# EAGLE design pcb_1love (EAGLE 9.6.1)
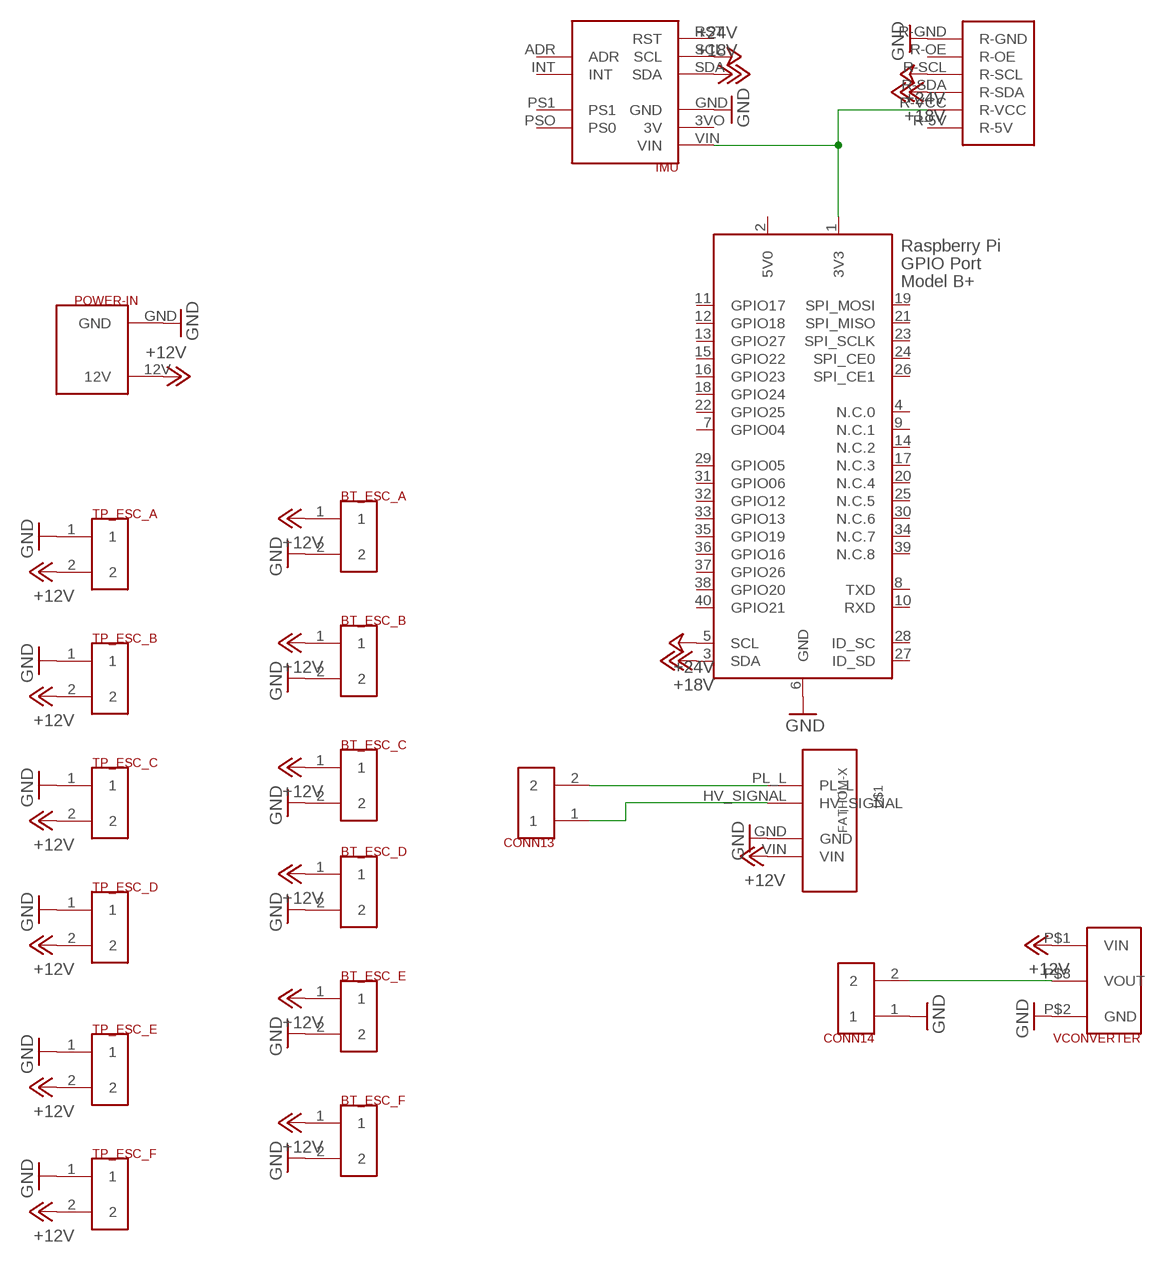
[diagram p0: schematic, sheet 1]

## Parts
BT_ESC_A  2CONTACT_ULTRAFIT_R/A  [2CONTAC_ULTRAFIT_R/A]
BT_ESC_B  2CONTACT_ULTRAFIT_R/A  [2CONTAC_ULTRAFIT_R/A]
BT_ESC_C  2CONTACT_ULTRAFIT_R/A  [2CONTAC_ULTRAFIT_R/A]
BT_ESC_D  2CONTACT_ULTRAFIT_R/A  [2CONTAC_ULTRAFIT_R/A]
BT_ESC_E  2CONTACT_ULTRAFIT_R/A  [2CONTAC_ULTRAFIT_R/A]
BT_ESC_F  2CONTACT_ULTRAFIT_R/A  [2CONTAC_ULTRAFIT_R/A]
CONN13  2CONTACT_ULTRAFIT_R/A  [2CONTAC_ULTRAFIT_R/A]
CONN14  2CONTACT_ULTRAFIT_R/A  [2CONTAC_ULTRAFIT_R/A]
IMU  IMU  [IMU]
POWER-IN  2-CONTACT-SUPER  [2-CONTACT-SUPER]
PWM_EXT  PWM_EXTENDER-SIMPLE  [PWM_EXTENDER-SIMPLE]
TP_ESC_A  2CONTACT_ULTRAFIT_R/A  [2CONTAC_ULTRAFIT_R/A]
TP_ESC_B  2CONTACT_ULTRAFIT_R/A  [2CONTAC_ULTRAFIT_R/A]
TP_ESC_C  2CONTACT_ULTRAFIT_R/A  [2CONTAC_ULTRAFIT_R/A]
TP_ESC_D  2CONTACT_ULTRAFIT_R/A  [2CONTAC_ULTRAFIT_R/A]
TP_ESC_E  2CONTACT_ULTRAFIT_R/A  [2CONTAC_ULTRAFIT_R/A]
TP_ESC_F  2CONTACT_ULTRAFIT_R/A  [2CONTAC_ULTRAFIT_R/A]
U$1  FATHOM-X  [FATHOM-X]
VCONVERTER  VOLTAGE_CONVERTER  [VOLTAGE_CONVERTERS]
X1  RASPI_BOARD_B+_F  [RASPI_BOARD_B+_FULL]

## Nets
+12V: BT_ESC_A.1 BT_ESC_B.1 BT_ESC_C.1 BT_ESC_D.1 BT_ESC_E.1 BT_ESC_F.1 POWER-IN.12V TP_ESC_A.2 TP_ESC_B.2 TP_ESC_C.2 TP_ESC_D.2 TP_ESC_E.2 TP_ESC_F.2 U$1.VIN VCONVERTER.P$1(VIN)
+18V: IMU.SDA PWM_EXT.R-SDA X1.3(SDA)
+24V: IMU.SCL PWM_EXT.R-SCL X1.5(SCL)
GND: BT_ESC_A.2 BT_ESC_B.2 BT_ESC_C.2 BT_ESC_D.2 BT_ESC_E.2 BT_ESC_F.2 CONN14.1 IMU.GND POWER-IN.GND PWM_EXT.R-GND TP_ESC_A.1 TP_ESC_B.1 TP_ESC_C.1 TP_ESC_D.1 TP_ESC_E.1 TP_ESC_F.1 U$1.GND VCONVERTER.P$2(GND) X1.6(GND)
N$1: CONN13.2 U$1.PL_L
N$2: CONN13.1 U$1.HV_SIGNAL
N$3: CONN14.2 VCONVERTER.P$3(VOUT)
N$4: IMU.VIN PWM_EXT.R-VCC X1.1(3V3)
Unconnected: IMU.3VO(3V) IMU.ADR IMU.INT IMU.PS1 IMU.PSO(PS0) IMU.RST PWM_EXT.R-5V PWM_EXT.R-OE X1.4(N.C.0) X1.7(GPIO04) X1.8(TXD) X1.9(N.C.1) X1.10(RXD) X1.11(GPIO17) X1.12(GPIO18) X1.13(GPIO27) X1.14(N.C.2) X1.15(GPIO22) X1.16(GPIO23) X1.17(N.C.3) X1.18(GPIO24) X1.19(SPI_MOSI) X1.20(N.C.4) X1.21(SPI_MISO) X1.22(GPIO25) X1.23(SPI_SCLK) X1.24(SPI_CE0) X1.25(N.C.5) X1.26(SPI_CE1) X1.27(ID_SD) X1.28(ID_SC) X1.29(GPIO05) X1.30(N.C.6) X1.31(GPIO06) X1.32(GPIO12) X1.33(GPIO13) X1.34(N.C.7) X1.35(GPIO19) X1.36(GPIO16) X1.37(GPIO26) X1.38(GPIO20) X1.39(N.C.8) X1.40(GPIO21)

## Power pins joined to a net without a drawn wire
5V0: X1.2(5V0)

## Library data of the parts
BT_ESC_A BT_ESC_B BT_ESC_C BT_ESC_D BT_ESC_E BT_ESC_F CONN13 CONN14 TP_ESC_B TP_ESC_C TP_ESC_D TP_ESC_E TP_ESC_F = BlueShift:2CONTACT_ULTRAFIT_R/A
IMU = BlueShift:IMU: adafruit.com/product/2472 github.com/adafruit/Adafruit-BNO055-Breakout-PCB
POWER-IN = BlueShift:2-CONTACT-SUPER
PWM_EXT = BlueShift:PWM_EXTENDER-SIMPLE
TP_ESC_A = BlueShift:2CONTACT_ULTRAFIT_R/A; SPICEPREFIX: B
U$1 = FathomX:FATHOM-X
VCONVERTER = BlueShift:VOLTAGE_CONVERTER
X1 = raspberrypi:RASPI_BOARD_B+: Raspberry Pi GPIO connector with markings for the outer dimensions of the Raspberry Pi board model B+ with different sets of drill holes or mounting pads

## Board
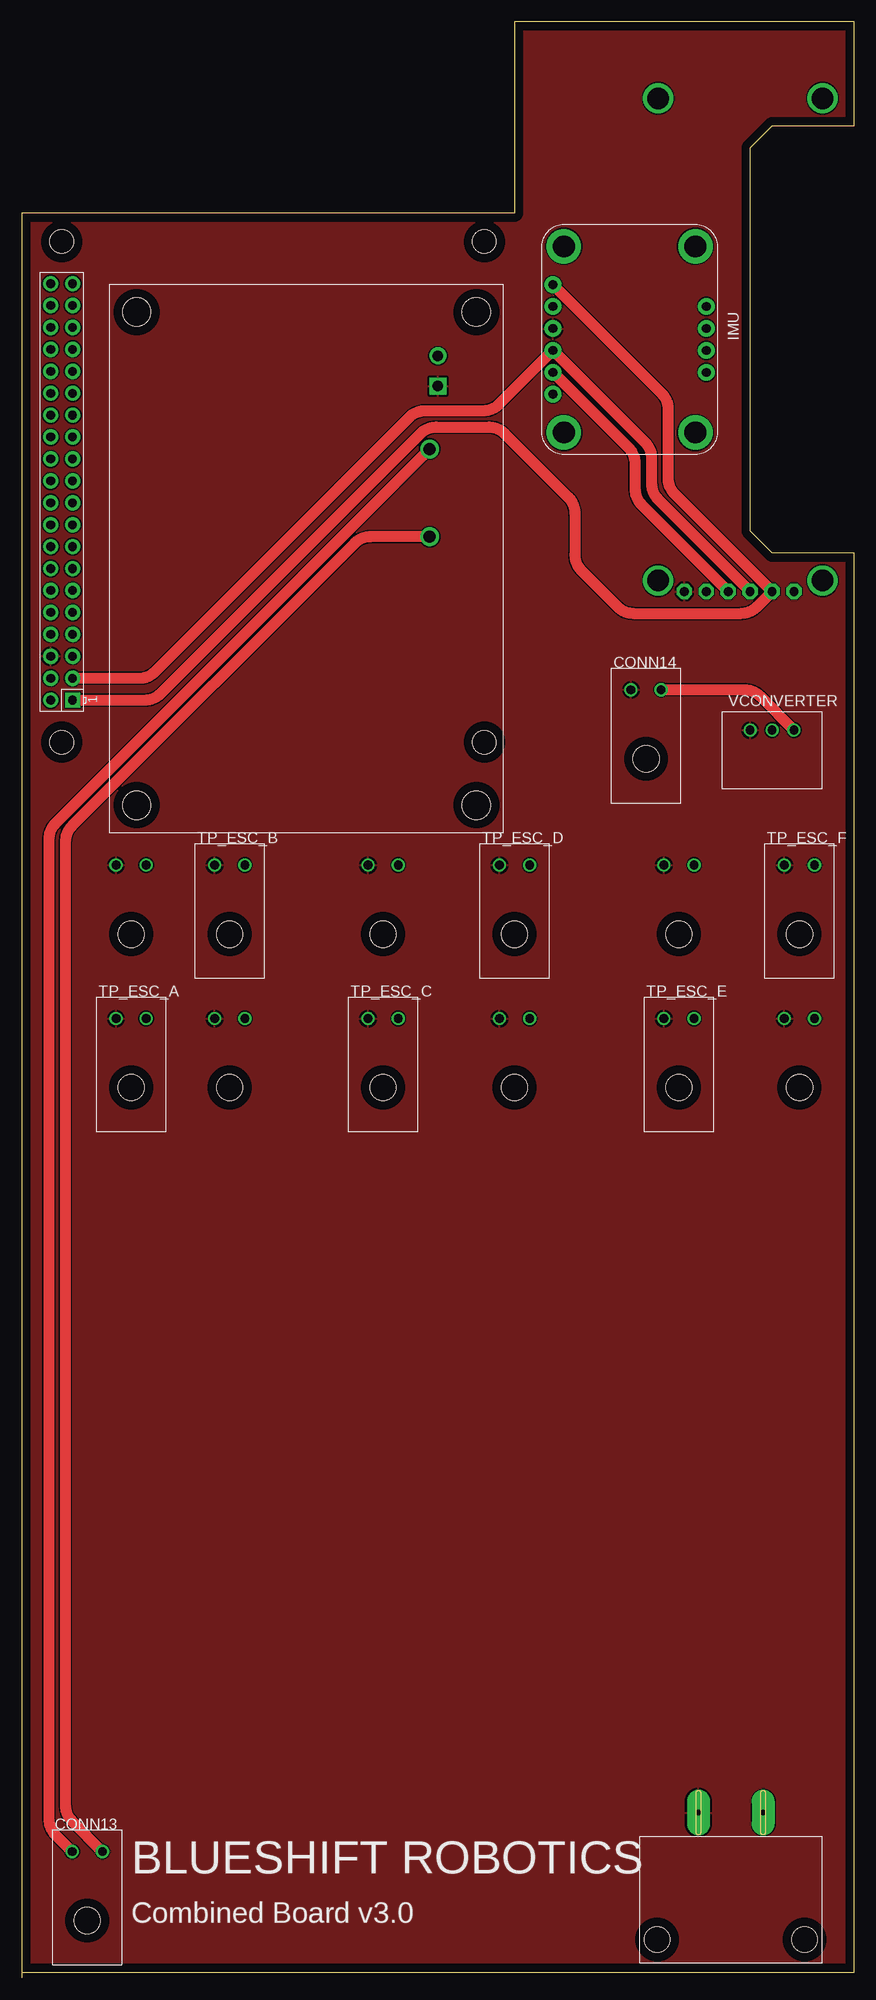
[diagram p1: board, top side]
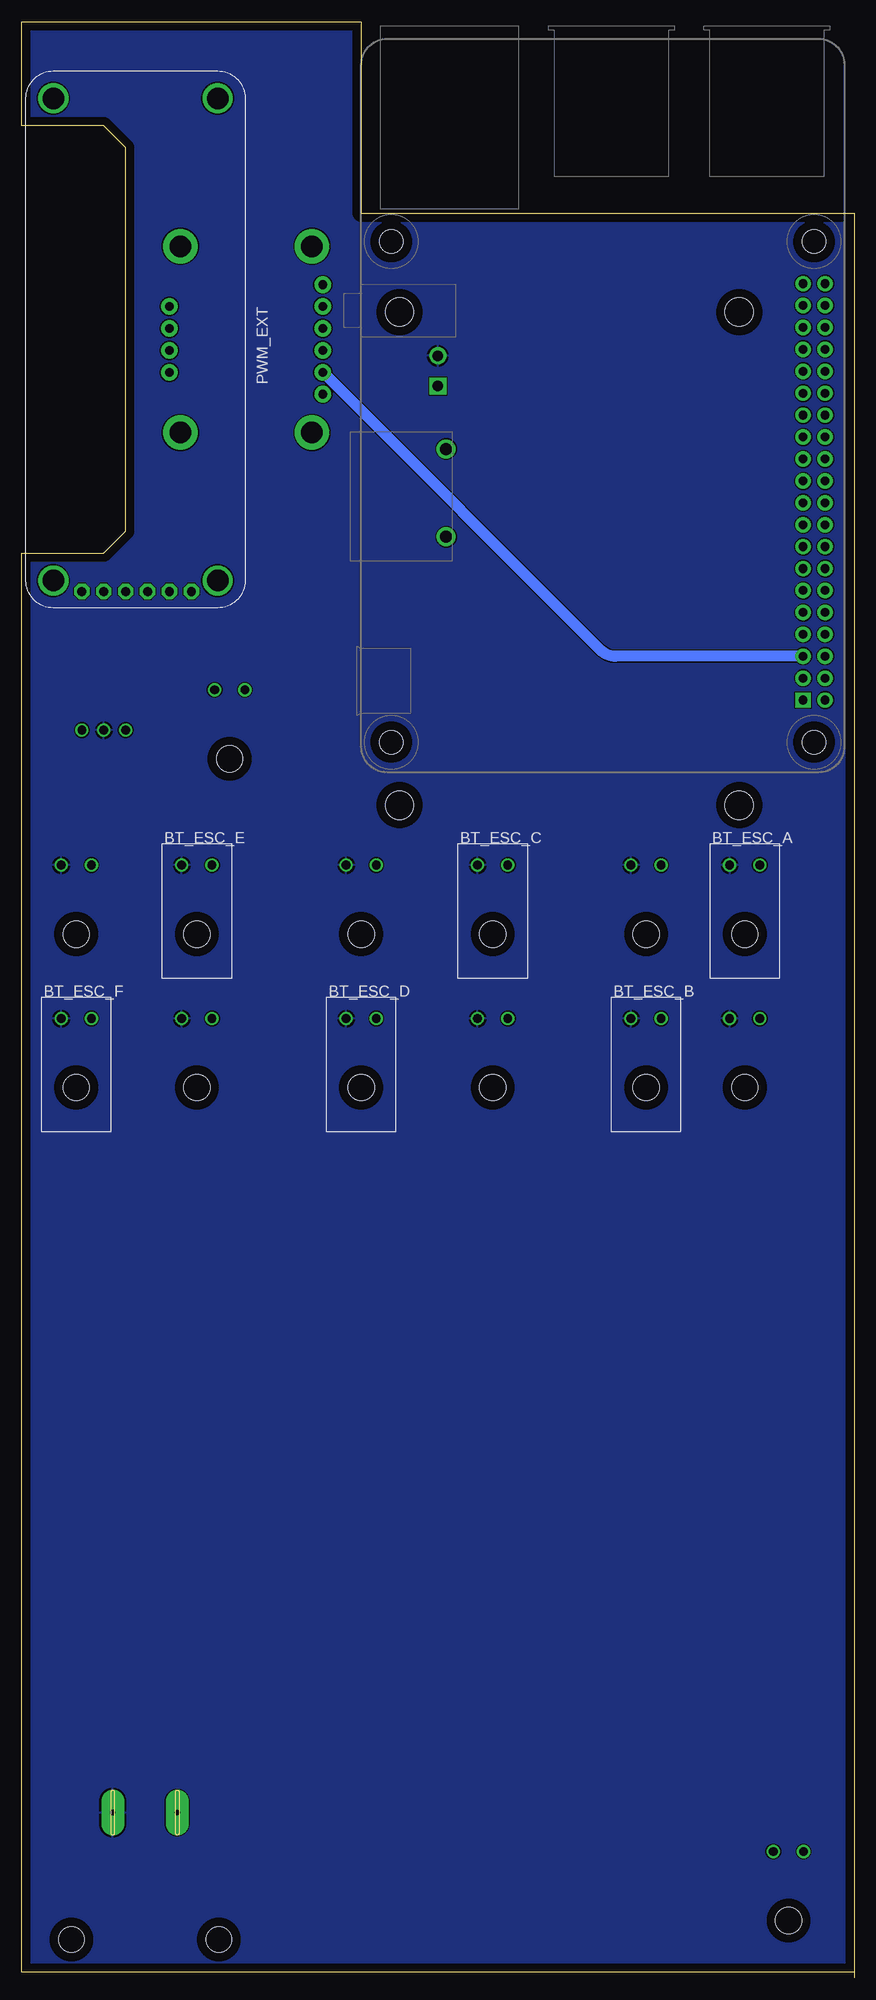
[diagram p2: board, bottom side, seen from below]

Size 96.52 x 226.69 mm. Coordinates in mm from the lower left corner, seen from the top.
Outline: 0,0.64 0,204.47 57.15,204.47 57.15,226.69 96.52,226.69 96.52,214.63 87,214.63 84.45,212.09 84.45,167.64 87,165.1 96.52,165.1 96.52,0.64 0,0.64
Outline: 0,0.64 0,0
Copper layers (1*16): Top 0.035mm / dielectric 1.5mm / Bottom 0.035mm
Design rules "default": minimum track width 6mil, minimum drill 0.35mm, track to track 6mil, track to pad 6mil, pad to pad 6mil, via to via 6mil, smd to smd 6mil, copper to edge 40mil, drill to drill 6mil, minimum pad ring 10mil, minimum via ring 8mil, stop-mask expansion 4mil, vias tented up to drill 0mil, thermal gap 10mil

### Footprints (pad centres in the part's own frame; a part is rotated, then mirrored left to right if it is on the bottom)
2CONTAC_ULTRAFIT_R/A = drill 1.02: 1 -1.75,-2.5; 2 1.75,-2.5 | hole 3.05: 0,-10.5
IMU = drill 1 pad 1.93: 3VO 9.525,1.27; ADR 17.145,19.05; GND 12.065,1.27; INT 14.605,19.05; PS1 12.065,19.05; PSO 9.525,19.05; RST 19.685,1.27; SCL 17.145,1.27; SDA 14.605,1.27; VIN 6.985,1.27 | drill 2.5 pad 4: BLMOUNT 2.54,2.54; BRMOUNT 24.13,2.54; TLMOUNT 2.54,17.78; TRMOUNT 24.13,17.78
2-CONTACT-SUPER = drill 0.6 pad 2.65 long: 12V -12.29,-14.715; GND -4.8,-14.715 | hole 3: 0,0; -17.09,0
PWM_EXTENDER-SIMPLE = drill 2.489 pad 3.2: BLMOUNT 1.27,-3.302; BRMOUNT 57.15,-3.302; TLMOUNT 1.27,15.748; TRMOUNT 57.15,15.748 | drill 1.016 pad 1.778 octagon: R-5V 58.42,0; R-GND 58.42,12.7; R-OE 58.42,10.16; R-SCL 58.42,7.62; R-SDA 58.42,5.08; R-VCC 58.42,2.54
FATHOM-X = drill 1.2 pad 1.981 square: GND 51.752,7.62 | drill 1.397 pad 2.184: HV_SIGNAL 44.45,8.572; PL_L 34.29,8.572 | drill 1.2 pad 1.981: VIN 55.252,7.62 | hole 3.302: 3.175,42.545; 60.325,42.545; 60.325,3.175; 3.175,3.175
VOLTAGE_CONVERTERS = drill 1: P$1 0,2.35; P$2 -2.54,2.35; P$3 2.54,2.35
RASPI_BOARD_B+_FULL = drill 1 pad 1.778 square: 1 8.37,51.23 | drill 1 pad 1.778: 2 8.37,53.77; 3 10.91,51.23; 4 10.91,53.77; 5 13.45,51.23; 6 13.45,53.77; 7 15.99,51.23; 8 15.99,53.77; 9 18.53,51.23; 10 18.53,53.77; 11 21.07,51.23; 12 21.07,53.77; 13 23.61,51.23; 14 23.61,53.77; 15 26.15,51.23; 16 26.15,53.77; 17 28.69,51.23; 18 28.69,53.77; 19 31.23,51.23; 20 31.23,53.77; 21 33.77,51.23; 22 33.77,53.77; 23 36.31,51.23; 24 36.31,53.77; 25 38.85,51.23; 26 38.85,53.77; 27 41.39,51.23; 28 41.39,53.77; 29 43.93,51.23; 30 43.93,53.77; 31 46.47,51.23; 32 46.47,53.77; 33 49.01,51.23; 34 49.01,53.77; 35 51.55,51.23; 36 51.55,53.77; 37 54.09,51.23; 38 54.09,53.77; 39 56.63,51.23; 40 56.63,53.77 | hole 2.75: 3.5,3.5; 3.5,52.5; 61.5,3.5; 61.5,52.5

### Placement (x,y rotation side)
BT_ESC_A  12.7,131.44 0 bottom
BT_ESC_B  24.13,113.67 0 bottom
BT_ESC_C  41.91,131.44 0 bottom
BT_ESC_D  57.15,113.67 0 bottom
BT_ESC_E  76.2,131.44 0 bottom
BT_ESC_F  90.17,113.67 0 bottom
CONN13  7.62,17.15 0 top
CONN14  72.39,151.76 0 top
IMU  60.33,203.2 270 top
POWER-IN  73.66,4.45 180 top
PWM_EXT  89.53,219.07 270 bottom
TP_ESC_A  12.7,113.67 0 top
TP_ESC_B  24.13,131.44 0 top
TP_ESC_C  41.91,113.67 0 top
TP_ESC_D  57.15,131.44 0 top
TP_ESC_E  76.2,113.67 0 top
TP_ESC_F  90.17,131.44 0 top
U$1  55.88,132.72 90 top
VCONVERTER  87,142.24 0 top
X1  57.15,139.7 90 top

### Tracks (layer width: path | path; a pad name or v marks a point on that pad's centre or on a via)
+12V
  pour Bottom: -6.35,233.04 -6.35,-1.91 -1.27,-6.99 99.06,-6.99 102.87,-3.17 102.87,234.31 -5.08,234.31
+18V
  Top 1.27: PWM_EXT.R-SDA 73.77,171.34 arc-45 73.03,173.14 73.03,176.11 arc45 72.28,177.91 IMU.SDA 55.35,182.35 arc-45 53.56,181.61 46.77,181.61 arc45 44.98,180.87 15.46,151.35 arc-45 13.67,150.61 X1.3
+24V
  Top 1.27: IMU.SCL 70.38,177.27 arc-45 71.12,175.48 71.12,172.5 arc45 71.86,170.71 PWM_EXT.R-SCL
  Bottom 1.27: X1.5 27.64,153.15 arc45 29.43,153.89 IMU.SCL
GND
  pour Top: -7.62,233.04 -7.62,-6.99 104.14,-6.99 104.14,234.31 -6.35,234.31
N$1
  Top 1.27: U$1.PL_L 40.42,167 arc45 38.63,166.26 5.82,133.46 arc45 5.08,131.66 5.08,19.99 arc45 5.82,18.19 CONN13.2
N$2
  Top 1.27: U$1.HV_SIGNAL 3.92,133.78 arc45 3.17,131.98 3.17,18.39 arc45 3.92,16.6 CONN13.1
N$3
  Top 1.27: CONN14.2 83.81,149.26 arc-45 85.6,148.52 VCONVERTER.P$3
N$4
  Top 1.27: IMU.VIN 74.19,183.62 arc-45 74.93,181.83 74.93,173.77 arc45 75.67,171.98 PWM_EXT.R-VCC 85.2,158.86 arc-45 83.4,158.11 70.9,158.11 arc-45 69.11,158.86 64.88,163.09 arc-45 64.14,164.88 64.14,169.76 arc45 63.39,171.56 55.99,178.96 arc45 54.19,179.7 48.04,179.7 arc45 46.25,178.96 16.1,148.81 arc-45 14.3,148.07 X1.1

### Text on the board
tPlace: BLUESHIFT ROBOTICS | Combined Board v3.0